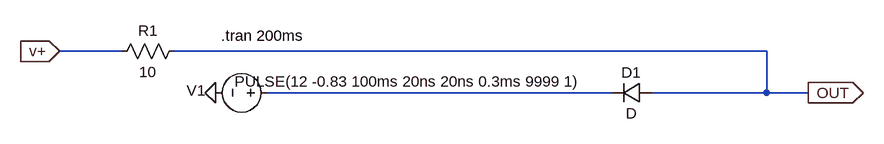
[diagram p0: schematic UARTfaker-Glitch.asc]
UARTfaker-Glitch.asc, the LTspice schematic file:
Version 4
SHEET 1 1560 944
WIRE -304 144 -400 144
WIRE 688 144 -224 144
WIRE 448 208 -80 208
WIRE 688 208 688 144
WIRE 688 208 512 208
WIRE 752 208 688 208
FLAG -160 208 0
FLAG 752 208 OUT
IOPIN 752 208 Out
FLAG -400 144 v+
IOPIN -400 144 In
SYMBOL voltage -64 208 R90
WINDOW 0 12 126 VBottom 2
WINDOW 3 -33 -201 VTop 2
SYMATTR InstName V1
SYMATTR Value PULSE(12 -0.83 100ms 20ns 20ns 0.3ms 9999 1)
SYMBOL diode 512 192 R90
WINDOW 0 0 32 VBottom 2
WINDOW 3 32 32 VTop 2
SYMATTR InstName D1
SYMBOL res -208 128 R90
WINDOW 0 0 56 VBottom 2
WINDOW 3 32 56 VTop 2
SYMATTR InstName R1
SYMATTR Value 10
TEXT -152 120 Left 2 !.tran 200ms

The netlist it stands for:
* UARTfaker-Glitch.asc
V1 N001 0 PULSE(12 -0.83 100ms 20ns 20ns 0.3ms 9999 1)
D1 OUT N001 D
R1 OUT v+ 10
.model D D
.lib standard.dio
.tran 200ms
.backanno
.end